# Altium schematic sheet BLOCK_DIAGRAM_TABLE_OF_SHEETS.SchDoc: MICRO HDMI INTERFACE
size C; CheckedBy: R. COXE; CompanyName: Atom Computing; DrawnBy: K. BARNES; Engineer: K. BARNES; Organization: Atom Computing Inc.; Address1: 918 Parker St.; Address2: Suite A-13; Address3: Berkeley, CA; Address4: 94710; DocumentNumber: 2020-07-02; Revision: B.2; SheetNumber: 1; SheetTotal: 4; PageSetup: Record=PageOptions|CenterHorizontal=True|CenterVertical=True|PrintScale=1.09|XCorrection=1.00|YCorrection=1.00|PrintKind=1|BorderSize=5000000|LeftOffset=0|BottomOffset=0|Orientation=2|PaperLength=4318|PaperWidth=2794|Scale=100|PaperSource=1025|PrintQuality=600|MediaType=256|DitherType=0|PrintScaleMode=1|PaperKind=11" x 17"|PaperIndex=17; Size: C; ReleaseYear: 2024; BoardTitle: MICRO HDMI INTERFACE; DateDrawn: 04/18/2024; DateENG: 04/18/2024; Approved1: R. COXE; DateChecked: 04/18/2024; DescriptionA: ENGINEERING RELEASE; DescriptionB: SWAP SCL/SDA ON U10, INCREASE R39 VALUE; ApprovedA: R. COXE; ApprovedB: R. COXE; DateRevisionA: 04/18/2024; DateRevisionB: 08/28/2024; RevisionA: A; RevisionB: B.1; DescriptionC: CHANGED U8 TO MAC VERSION; RevisionC: B.2; DateRevisionC: 09/26/2024; ApprovedC: R. COXE
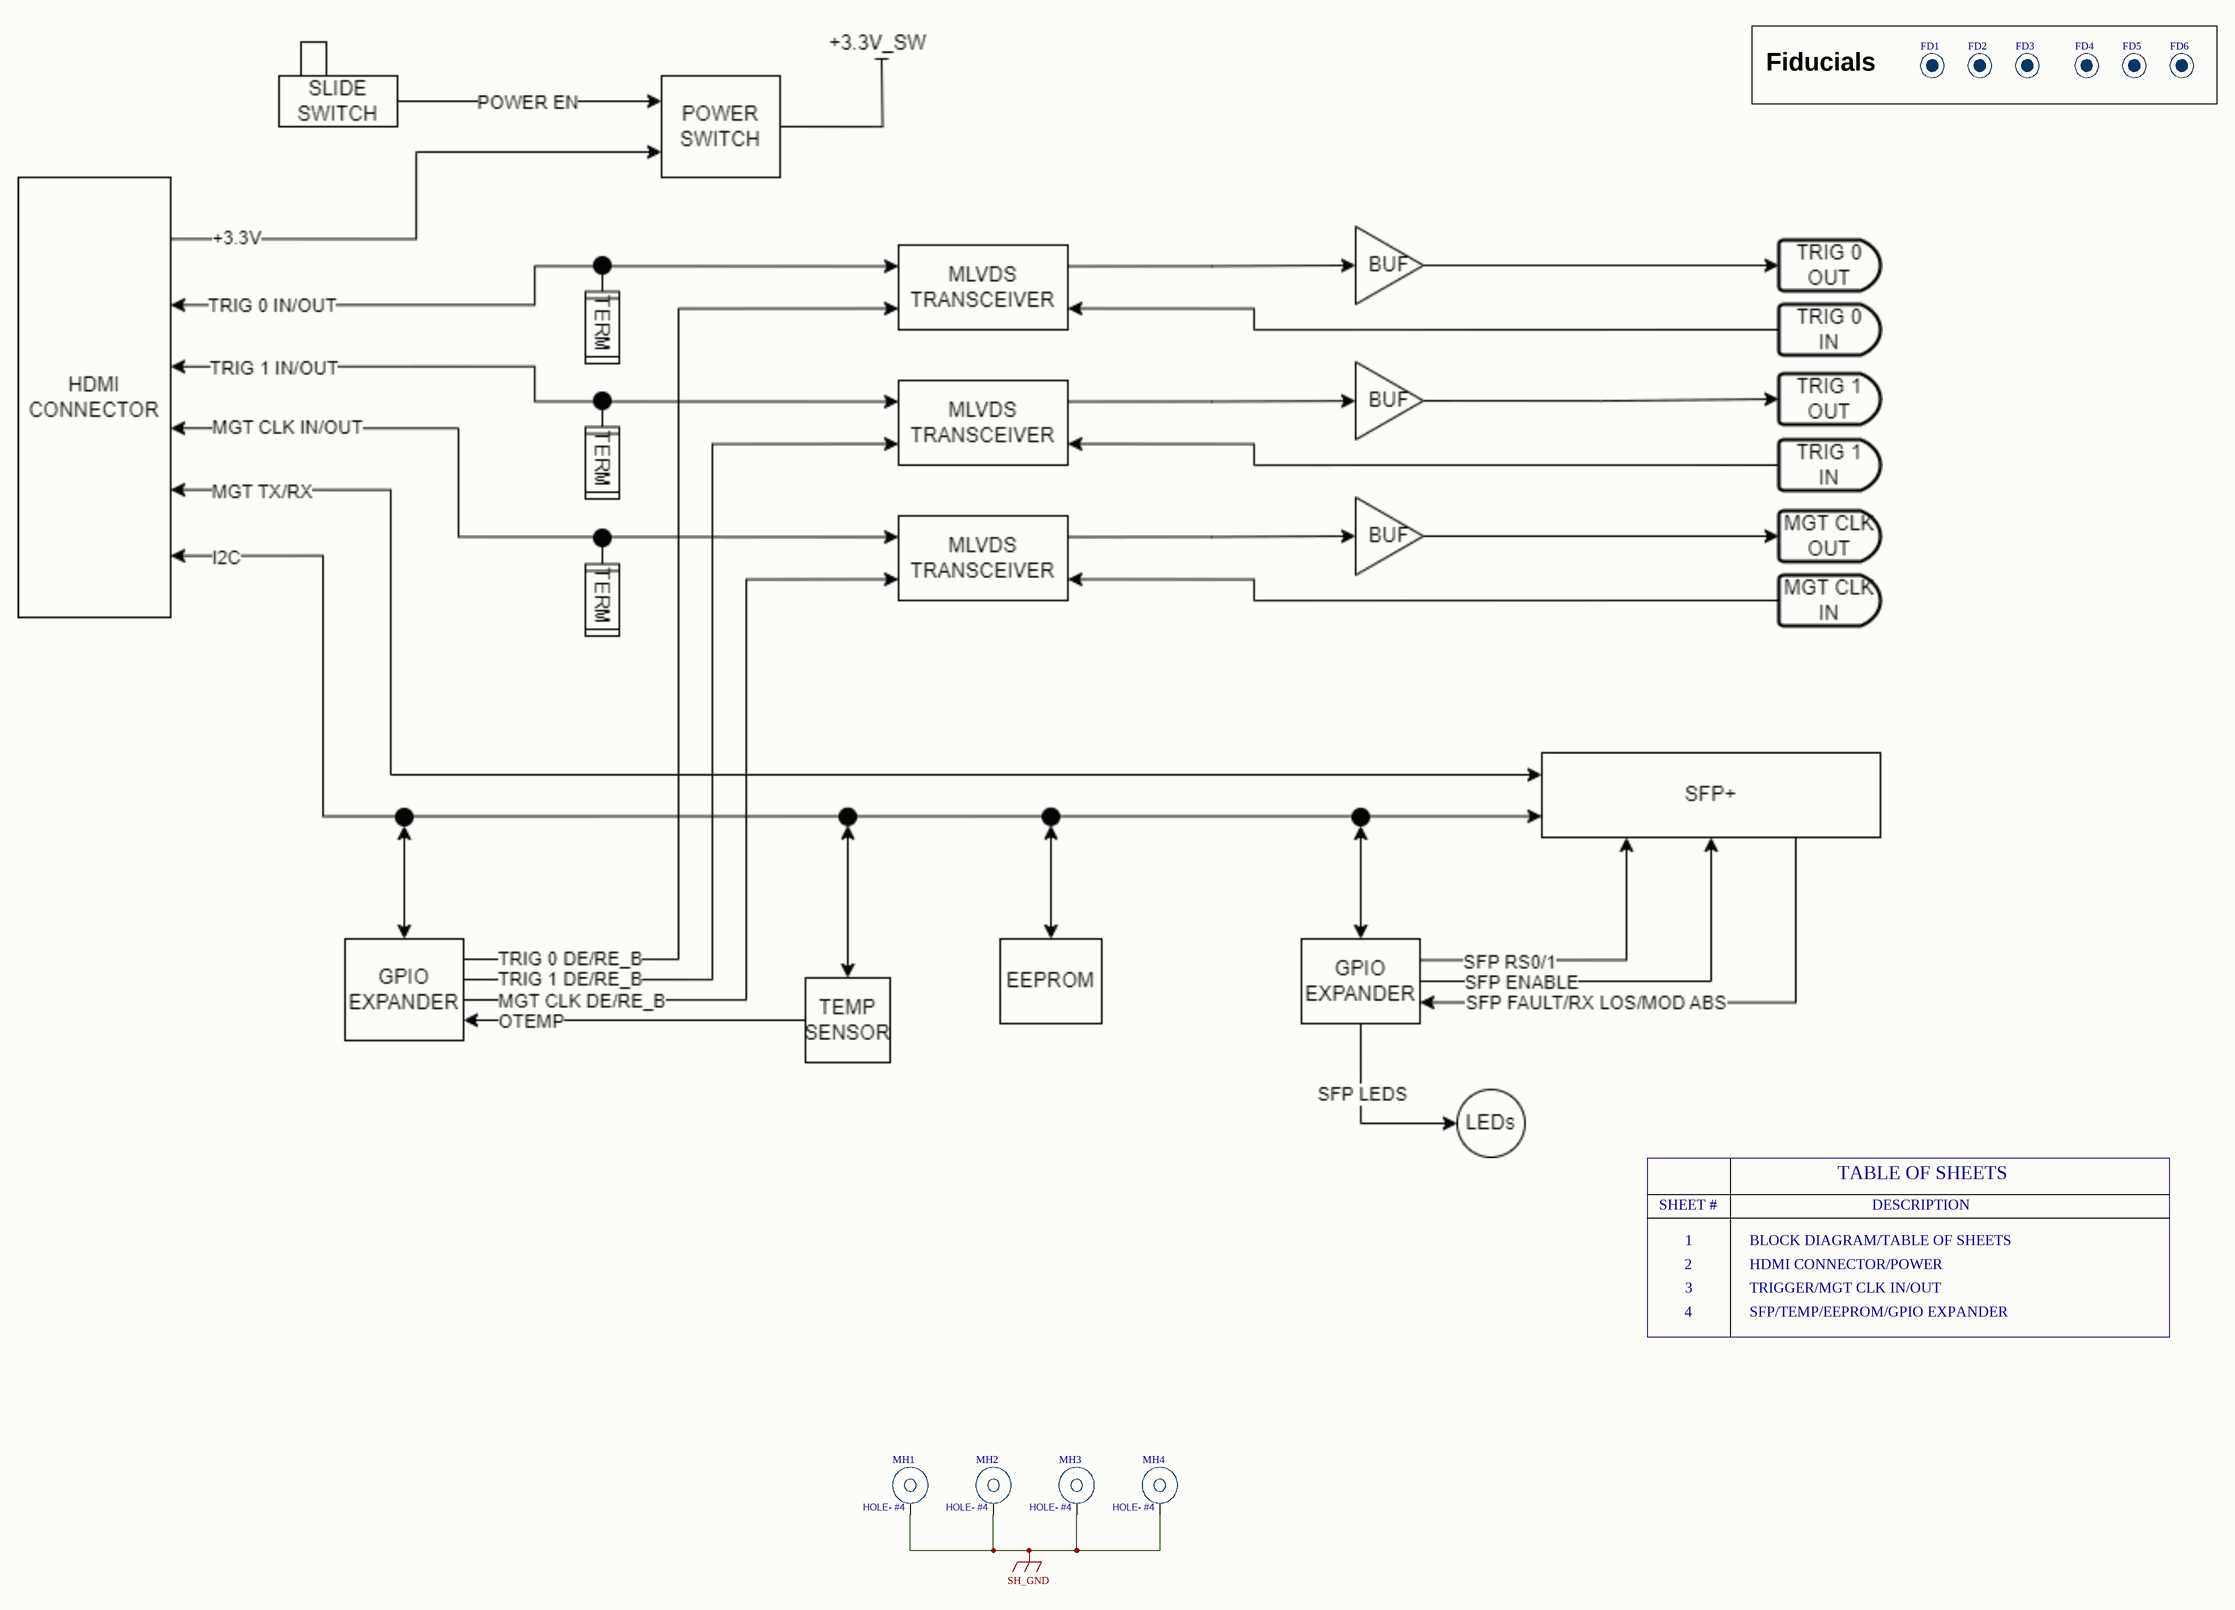
[diagram p0: BLOCK_DIAGRAM_TABLE_OF_SHEETS.SchDoc]

## Parts
FD1  FIDUCIAL  [FIDUCIAL-GT]  (value not drawn)  (no BOM)
FD2  FIDUCIAL  [FIDUCIAL-GT]  (value not drawn)  (no BOM)
FD3  FIDUCIAL  [FIDUCIAL-GT]  (value not drawn)  (no BOM)
FD4  FIDUCIAL  [FIDUCIAL-GT]  (value not drawn)  (no BOM)
FD5  FIDUCIAL  [FIDUCIAL-GT]  (value not drawn)  (no BOM)
FD6  FIDUCIAL  [FIDUCIAL-GT]  (value not drawn)  (no BOM)
MH1  HOLE- #4  [HOLE - #4 screw]  (no BOM)
MH2  HOLE- #4  [HOLE - #4 screw]  (no BOM)
MH3  HOLE- #4  [HOLE - #4 screw]  (no BOM)
MH4  HOLE- #4  [HOLE - #4 screw]  (no BOM)

## Blocks framed on the sheet
Fiducials: FD1-FD6

## Nets
SH_GND: MH1.1(GND) MH2.1(GND) MH3.1(GND) MH4.1(GND)

## Notes on the sheet
- TABLE OF SHEETS
- SHEET #
- DESCRIPTION
- 2
- 3
- 1
- TRIGGER/MGT CLK IN/OUT
- HDMI CONNECTOR/POWER
- BLOCK DIAGRAM/TABLE OF SHEETS
- 4
- SFP/TEMP/EEPROM/GPIO EXPANDER
- REV
- REVISIONS
- DATE
- APPROVED
- ,
- DRAWN
- ENG
- SCHEMATIC,
- "This documentation describes Open Hardware and is licensed under the CC BY-SA 4.0. You may redistribute and modify this documentation under the terms of
- CC BY-SA 4.0. (https://creativecommons.org/licenses/by-sa/4.0/). This documentation is distributed WITHOUT ANY EXPRESS OR IMPLIED WARRANTY,
- INCLUDING OF MERCHANTABILITY, SATISFACTORY QUALITY AND FITNESS FOR A PARTICULAR PURPOSE."  COPYRIGHT ©
- Atom Computing, Inc.
- CHKD
- SIZE
- FILE NAME
- PAGE
- OF

## Library data of the parts
FD1-FD6 = CMP-00028-00000-3: Mfg: PCB FEATURE; Pins: 0; Mfg PN: FIDUCIAL
MH1-MH4 = CMP-028-00002-1: Mounting Hole for #4 screw; Mfg: NA; Case/Package: #4; Pins: 1; Mfg PN: HOLE